# Altium schematic sheet Sheet1.SchDoc
size A; Date: June 16/2018; DrawnBy: Mitchell Stride; DocumentName: Wireless 555 Power Transfer
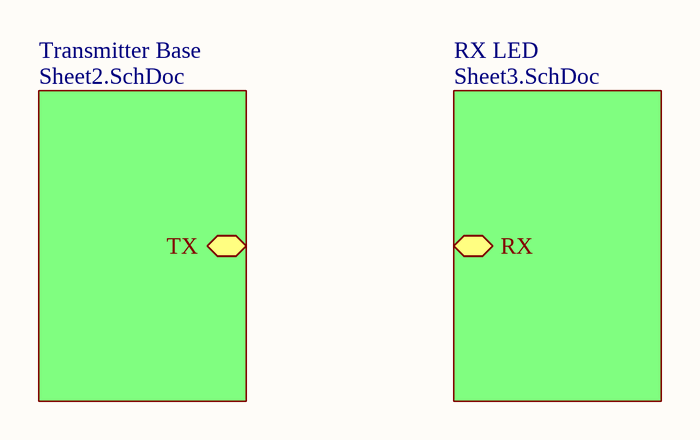
[diagram p0: Sheet1.SchDoc]

## Sub-sheets
RX LED = Sheet3.SchDoc: RX
Transmitter Base = Sheet2.SchDoc: TX